# Altium schematic sheet microcontroller.SchDoc
size A
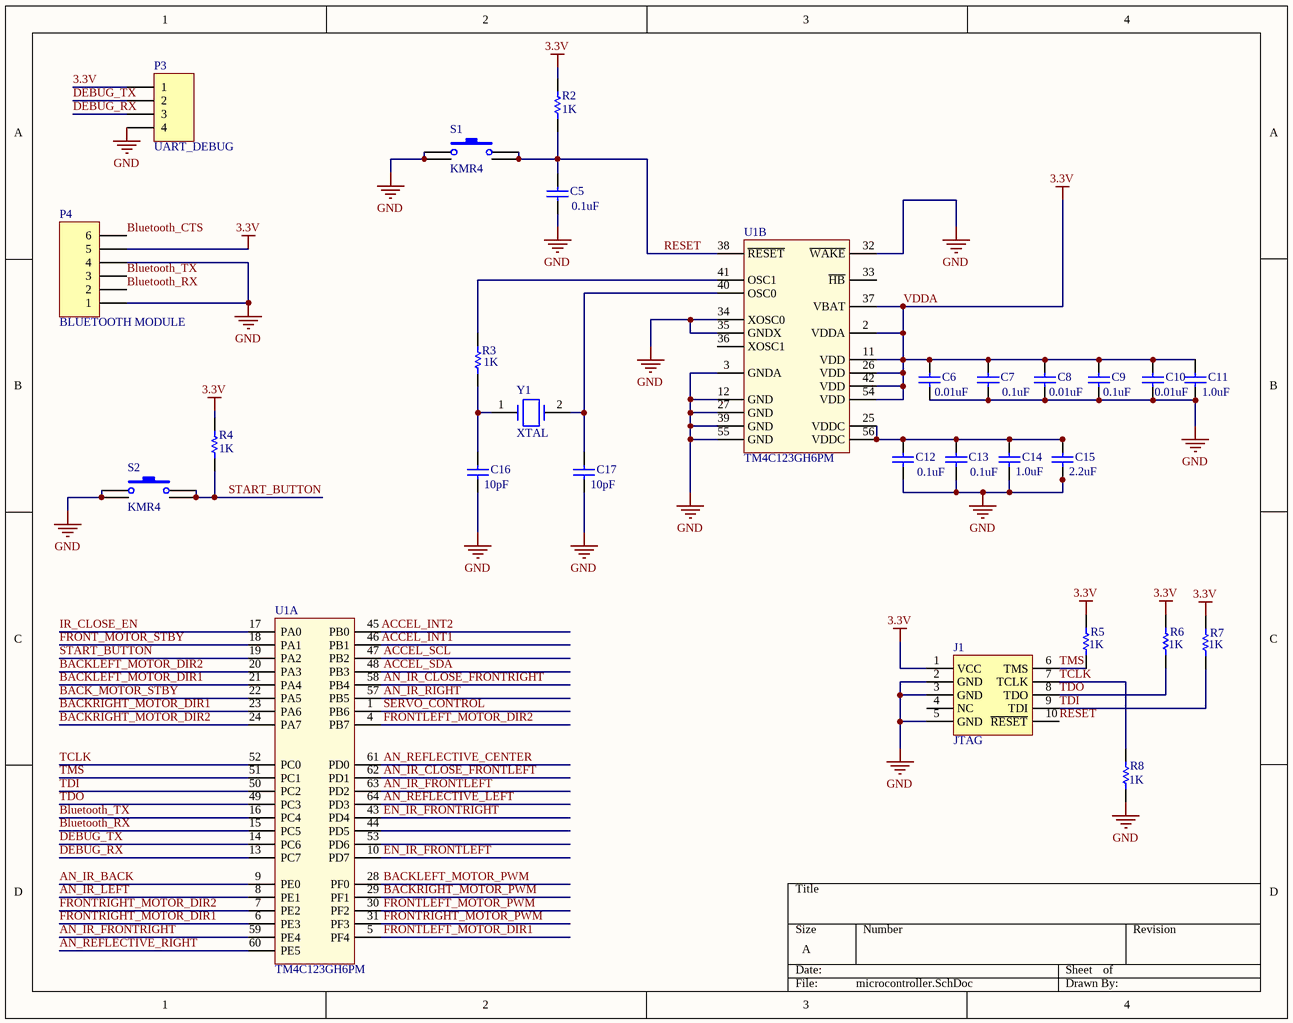
[diagram p0: microcontroller.SchDoc]

## Parts
C5  value 0.1uF  [0805]  (hidden comment: Cap)
C6  value 0.01uF  [0805]  (hidden comment: Cap)
C7  value 0.1uF  [0805]  (hidden comment: Cap)
C8  value 0.01uF  [0805]  (hidden comment: Cap)
C9  value 0.1uF  [0805]  (hidden comment: Cap)
C10  value 0.01uF  [0805]  (hidden comment: Cap)
C11  value 1.0uF  [0805]  (hidden comment: Cap)
C12  value 0.1uF  [0805]  (hidden comment: Cap)
C13  value 0.1uF  [0805]  (hidden comment: Cap)
C14  value 1.0uF  [0805]  (hidden comment: Cap)
C15  value 2.2uF  [0805]  (hidden comment: Cap)
C16  value 10pF  [0805]  (hidden comment: Cap)
C17  value 10pF  [0805]  (hidden comment: Cap)
J1  JTAG  [TAG Connect 10p]
P3  UART_DEBUG  [HDR1X4]
P4  BLUETOOTH MODULE  [HDR1X6]
R2  value 1K  [0805]  (hidden comment: Resistor)
R3  value 1K  [0805]  (hidden comment: Resistor)
R4  value 1K  [0805]  (hidden comment: Resistor)
R5  value 1K  [0805]  (hidden comment: Resistor)
R6  value 1K  [0805]  (hidden comment: Resistor)
R7  value 1K  [0805]  (hidden comment: Resistor)
R8  value 1K  [0805]  (hidden comment: Resistor)
S1  KMR4  [KMR4]
S2  KMR4  [KMR4]
U1  TM4C123GH6PM  [TSQFP50P1200X1200X145-64N]  (parts A,B of 2)
Y1  XTAL  [ABM3_SERIES]

## Nets
3.3V: C6.2 C7.2 C8.2 C9.2 C10.2 C11.2 J1.1(VCC) P3.1 P4.5 R2.2 R4.2 R5.2 R6.2 R7.2 U1.2(VDDA) U1.11(VDD) U1.26(VDD) U1.37(VBAT) U1.42(VDD) U1.54(VDD)  [also labelled VDDA]
GND: C5.1 C6.1 C7.1 C8.1 C9.1 C10.1 C11.1 C12.1 C13.1 C14.1 C15.1 C16.1 C17.1 J1.2(GND) J1.3(GND) J1.5(GND) P3.4 P4.1 P4.4 R8.1 S1.1 S1.3 S2.1 S2.3 U1.3(GNDA) U1.12(GND) U1.27(GND) U1.32(~{WAKE}) U1.34(XOSC0) U1.35(GNDX) U1.39(GND) U1.55(GND)
ACCEL_INT1: U1.46(PB1)
ACCEL_INT2: U1.45(PB0)
ACCEL_SCL: U1.47(PB2)
ACCEL_SDA: U1.48(PB3)
AN_IR_BACK: U1.9(PE0)
AN_IR_CLOSE_FRONTLEFT: U1.62(PD1)
AN_IR_CLOSE_FRONTRIGHT: U1.58(PB4)
AN_IR_FRONTLEFT: U1.63(PD2)
AN_IR_FRONTRIGHT: U1.59(PE4)
AN_IR_LEFT: U1.8(PE1)
AN_IR_RIGHT: U1.57(PB5)
AN_REFLECTIVE_CENTER: U1.61(PD0)
AN_REFLECTIVE_LEFT: U1.64(PD3)
AN_REFLECTIVE_RIGHT: U1.60(PE5)
BACK_MOTOR_STBY: U1.22(PA5)
BACKLEFT_MOTOR_DIR1: U1.21(PA4)
BACKLEFT_MOTOR_DIR2: U1.20(PA3)
BACKLEFT_MOTOR_PWM: U1.28(PF0)
BACKRIGHT_MOTOR_DIR1: U1.23(PA6)
BACKRIGHT_MOTOR_DIR2: U1.24(PA7)
BACKRIGHT_MOTOR_PWM: U1.29(PF1)
Bluetooth_CTS: P4.6
Bluetooth_RX: P4.2 U1.15(PC5)
Bluetooth_TX: P4.3 U1.16(PC4)
DEBUG_RX: P3.3 U1.13(PC7)
DEBUG_TX: P3.2 U1.14(PC6)
EN_IR_FRONTLEFT: U1.10(PD7)
EN_IR_FRONTRIGHT: U1.43(PD4)
FRONT_MOTOR_STBY: U1.18(PA1)
FRONTLEFT_MOTOR_DIR1: U1.5(PF4)
FRONTLEFT_MOTOR_DIR2: U1.4(PB7)
FRONTLEFT_MOTOR_PWM: U1.30(PF2)
FRONTRIGHT_MOTOR_DIR1: U1.6(PE3)
FRONTRIGHT_MOTOR_DIR2: U1.7(PE2)
FRONTRIGHT_MOTOR_PWM: U1.31(PF3)
IR_CLOSE_EN: U1.17(PA0)
RESET: C5.2 J1.10(~{RESET}) R2.1 S1.2 S1.4 U1.38(~{RESET})
SERVO_CONTROL: U1.1(PB6)
START_BUTTON: R4.1 S2.2 S2.4 U1.19(PA2)
TCLK: J1.7(TCLK) R8.2 U1.52(PC0)
TDI: J1.9(TDI) R7.1 U1.50(PC2)
TDO: J1.8(TDO) R6.1 U1.49(PC3)
TMS: J1.6(TMS) R5.1 U1.51(PC1)
NetC12_2: C12.2 C13.2 C14.2 C15.2 U1.25(VDDC) U1.56(VDDC)
NetC16_2: C16.2 R3.1 Y1.1(OSC1)
NetC17_2: C17.2 U1.40(OSC0) Y1.2(OSC2)
NetR3_2: R3.2 U1.41(OSC1)

Not connected (* = marked no-connect by the designer): J1 4(NC); U1 33(~{HB}) 36(XOSC1) 44(PD5) 53(PD6)

## Library data of the parts
C5-C17 = Cap: Capacitor
J1 = 10-Pin JTAG ARM: 10-Pin JTAG Connector for Cortex M4 etc.
P3 = Header 4: Header, 4-Pin; LatestRevisionDate: 17-Jul-2002; LatestRevisionNote: Re-released for DXP Platform.; Publisher: Altium Limited
P4 = Header 6: Header, 6-Pin; LatestRevisionDate: 17-Jul-2002; LatestRevisionNote: Re-released for DXP Platform.; Publisher: Altium Limited
S1 S2 = SPST Tactile Switch: Switch; Published: 24-Mar-1999; LatestRevisionDate: 17-Jul-2002; LatestRevisionNote: Re-released for DXP Platform.; PackageReference: SPST-2; Publisher: Altium Limited
U1 = TM4C123GH6PM: Tiva C TM4C123GH6PM
Y1 = XTAL: Crystal Oscillator; Published: 8-Jun-2000; LatestRevisionDate: 17-Jul-2002; LatestRevisionNote: Re-released for DXP Platform.; PackageReference: R38; Publisher: Altium Limited; PackageDescription: Crystal, Thru-Hole; 2 Leads; Body 3.1 x 8.2 mm (Dia.xH)
R2-R8 = Resistor: Published: 8-Jun-2000; LatestRevisionDate: 17-Jul-2002; LatestRevisionNote: Re-released for DXP Platform.; PackageReference: AXIAL-0.3; Publisher: Altium Limited